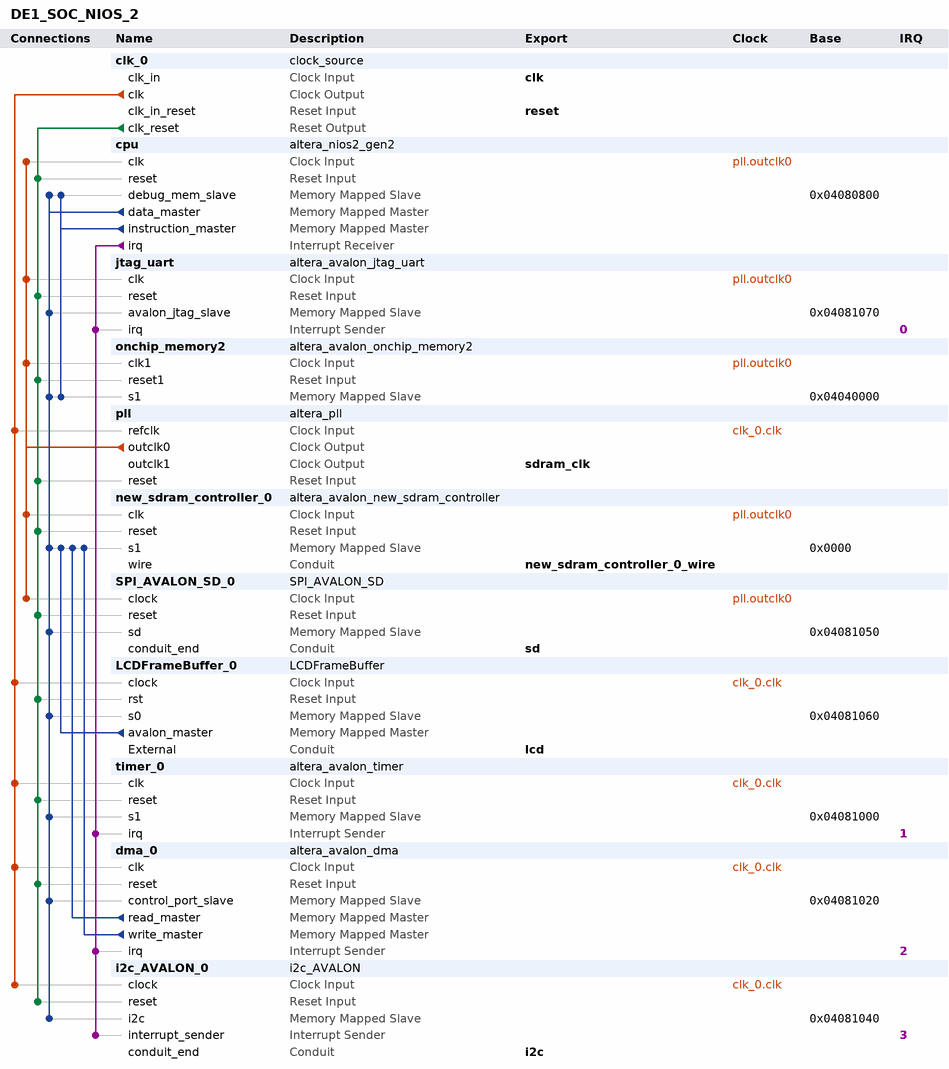
[diagram p0: system contents]
# Platform Designer (Qsys) system DE1_SOC_NIOS_2, Cyclone V 5CSEMA5F31C6
# Parameters at their usual value, and those the tool derives, are not listed.
package require -exact qsys 15.0
create_system DE1_SOC_NIOS_2
set_project_property DEVICE_FAMILY {Cyclone V}
set_project_property DEVICE 5CSEMA5F31C6

add_instance clk_0 clock_source 15.0
set_instance_parameter_value clk_0 clockFrequency 50000000

add_instance cpu altera_nios2_gen2 15.0
set_instance_parameter_value cpu dcache_size 2048
set_instance_parameter_value cpu exceptionSlave onchip_memory2.s1
set_instance_parameter_value cpu icache_size 4096
set_instance_parameter_value cpu impl Tiny
set_instance_parameter_value cpu resetSlave onchip_memory2.s1

add_instance jtag_uart altera_avalon_jtag_uart 15.0
set_instance_parameter_value jtag_uart simInteractiveOptions NO_INTERACTIVE_WINDOWS

add_instance onchip_memory2 altera_avalon_onchip_memory2 15.0
set_instance_parameter_value onchip_memory2 dataWidth 32
set_instance_parameter_value onchip_memory2 dualPort false
set_instance_parameter_value onchip_memory2 initMemContent true
set_instance_parameter_value onchip_memory2 initializationFileName onchip_mem.hex
set_instance_parameter_value onchip_memory2 memorySize 204800

add_instance pll altera_pll 15.0
set_instance_parameter_value pll gui_device_speed_grade 1
set_instance_parameter_value pll gui_number_of_clocks 2
set_instance_parameter_value pll gui_operation_mode direct
set_instance_parameter_value pll gui_output_clock_frequency0 100.0
set_instance_parameter_value pll gui_output_clock_frequency1 100.0
set_instance_parameter_value pll gui_phase_shift1 3000
set_instance_parameter_value pll gui_phase_shift_deg1 -52.0
set_instance_parameter_value pll gui_pll_mode {Integer-N PLL}
set_instance_parameter_value pll gui_reference_clock_frequency 50.0
set_instance_parameter_value pll gui_use_locked false

add_instance new_sdram_controller_0 altera_avalon_new_sdram_controller 15.0
set_instance_parameter_value new_sdram_controller_0 TAC 5.4
set_instance_parameter_value new_sdram_controller_0 TRCD 15.0
set_instance_parameter_value new_sdram_controller_0 TRP 15.0
set_instance_parameter_value new_sdram_controller_0 casLatency 3
set_instance_parameter_value new_sdram_controller_0 columnWidth 10
set_instance_parameter_value new_sdram_controller_0 dataWidth 16
set_instance_parameter_value new_sdram_controller_0 generateSimulationModel false
set_instance_parameter_value new_sdram_controller_0 model single_Micron_MT48LC4M32B2_7_chip
set_instance_parameter_value new_sdram_controller_0 numberOfBanks 4
set_instance_parameter_value new_sdram_controller_0 numberOfChipSelects 1
set_instance_parameter_value new_sdram_controller_0 powerUpDelay 100.0
set_instance_parameter_value new_sdram_controller_0 refreshPeriod 7.8125
set_instance_parameter_value new_sdram_controller_0 rowWidth 13

add_instance SPI_AVALON_SD_0 SPI_AVALON_SD 1.0

add_instance LCDFrameBuffer_0 LCDFrameBuffer 1.0

add_instance timer_0 altera_avalon_timer 15.0
set_instance_parameter_value timer_0 period 500
set_instance_parameter_value timer_0 periodUnits MSEC

add_instance dma_0 altera_avalon_dma 15.0
set_instance_parameter_value dma_0 allowByteTransactions false
set_instance_parameter_value dma_0 allowDoubleWordTransactions false
set_instance_parameter_value dma_0 allowHalfWordTransactions true
set_instance_parameter_value dma_0 allowQuadWordTransactions false
set_instance_parameter_value dma_0 allowWordTransactions false
set_instance_parameter_value dma_0 burstEnable false
set_instance_parameter_value dma_0 fifoDepth 32
set_instance_parameter_value dma_0 maxBurstSize 128
set_instance_parameter_value dma_0 minimumDmaTransactionRegisterWidth 20
set_instance_parameter_value dma_0 useRegistersForFIFO true

add_instance i2c_AVALON_0 i2c_AVALON 1.0

# connections
add_connection clk_0.clk dma_0.clk clock
add_connection clk_0.clk i2c_AVALON_0.clock clock
add_connection clk_0.clk LCDFrameBuffer_0.clock clock
add_connection clk_0.clk pll.refclk clock
add_connection clk_0.clk timer_0.clk clock
add_connection pll.outclk0 cpu.clk clock
add_connection pll.outclk0 jtag_uart.clk clock
add_connection pll.outclk0 new_sdram_controller_0.clk clock
add_connection pll.outclk0 onchip_memory2.clk1 clock
add_connection pll.outclk0 SPI_AVALON_SD_0.clock clock
add_connection clk_0.clk_reset cpu.reset reset
add_connection clk_0.clk_reset dma_0.reset reset
add_connection clk_0.clk_reset i2c_AVALON_0.reset reset
add_connection clk_0.clk_reset jtag_uart.reset reset
add_connection clk_0.clk_reset LCDFrameBuffer_0.rst reset
add_connection clk_0.clk_reset new_sdram_controller_0.reset reset
add_connection clk_0.clk_reset onchip_memory2.reset1 reset
add_connection clk_0.clk_reset pll.reset reset
add_connection clk_0.clk_reset SPI_AVALON_SD_0.reset reset
add_connection clk_0.clk_reset timer_0.reset reset
add_connection cpu.data_master cpu.debug_mem_slave avalon
set_connection_parameter_value cpu.data_master/cpu.debug_mem_slave baseAddress 0x04080800
add_connection cpu.data_master dma_0.control_port_slave avalon
set_connection_parameter_value cpu.data_master/dma_0.control_port_slave baseAddress 0x04081020
add_connection cpu.data_master i2c_AVALON_0.i2c avalon
set_connection_parameter_value cpu.data_master/i2c_AVALON_0.i2c baseAddress 0x04081040
add_connection cpu.data_master jtag_uart.avalon_jtag_slave avalon
set_connection_parameter_value cpu.data_master/jtag_uart.avalon_jtag_slave baseAddress 0x04081070
add_connection cpu.data_master LCDFrameBuffer_0.s0 avalon
set_connection_parameter_value cpu.data_master/LCDFrameBuffer_0.s0 baseAddress 0x04081060
add_connection cpu.data_master new_sdram_controller_0.s1 avalon
set_connection_parameter_value cpu.data_master/new_sdram_controller_0.s1 baseAddress 0x0000
add_connection cpu.data_master onchip_memory2.s1 avalon
set_connection_parameter_value cpu.data_master/onchip_memory2.s1 baseAddress 0x04040000
add_connection cpu.data_master SPI_AVALON_SD_0.sd avalon
set_connection_parameter_value cpu.data_master/SPI_AVALON_SD_0.sd baseAddress 0x04081050
add_connection cpu.data_master timer_0.s1 avalon
set_connection_parameter_value cpu.data_master/timer_0.s1 baseAddress 0x04081000
add_connection cpu.instruction_master cpu.debug_mem_slave avalon
set_connection_parameter_value cpu.instruction_master/cpu.debug_mem_slave baseAddress 0x04080800
add_connection cpu.instruction_master onchip_memory2.s1 avalon
set_connection_parameter_value cpu.instruction_master/onchip_memory2.s1 baseAddress 0x04040000
add_connection dma_0.read_master new_sdram_controller_0.s1 avalon
set_connection_parameter_value dma_0.read_master/new_sdram_controller_0.s1 baseAddress 0x0000
add_connection dma_0.write_master new_sdram_controller_0.s1 avalon
set_connection_parameter_value dma_0.write_master/new_sdram_controller_0.s1 baseAddress 0x0000
add_connection LCDFrameBuffer_0.avalon_master new_sdram_controller_0.s1 avalon
set_connection_parameter_value LCDFrameBuffer_0.avalon_master/new_sdram_controller_0.s1 baseAddress 0x0000
add_connection cpu.irq dma_0.irq interrupt
set_connection_parameter_value cpu.irq/dma_0.irq irqNumber 2
add_connection cpu.irq i2c_AVALON_0.interrupt_sender interrupt
set_connection_parameter_value cpu.irq/i2c_AVALON_0.interrupt_sender irqNumber 3
add_connection cpu.irq jtag_uart.irq interrupt
set_connection_parameter_value cpu.irq/jtag_uart.irq irqNumber 0
add_connection cpu.irq timer_0.irq interrupt
set_connection_parameter_value cpu.irq/timer_0.irq irqNumber 1

# exported interfaces
add_interface clk clock sink
set_interface_property clk EXPORT_OF clk_0.clk_in
add_interface i2c conduit end
set_interface_property i2c EXPORT_OF i2c_AVALON_0.conduit_end
add_interface lcd conduit end
set_interface_property lcd EXPORT_OF LCDFrameBuffer_0.External
add_interface new_sdram_controller_0_wire conduit end
set_interface_property new_sdram_controller_0_wire EXPORT_OF new_sdram_controller_0.wire
add_interface reset reset sink
set_interface_property reset EXPORT_OF clk_0.clk_in_reset
add_interface sd conduit end
set_interface_property sd EXPORT_OF SPI_AVALON_SD_0.conduit_end
add_interface sdram_clk clock source
set_interface_property sdram_clk EXPORT_OF pll.outclk1

set_interconnect_requirement {$system} qsys_mm.clockCrossingAdapter HANDSHAKE
set_interconnect_requirement {$system} qsys_mm.enableEccProtection FALSE
set_interconnect_requirement {$system} qsys_mm.insertDefaultSlave FALSE
set_interconnect_requirement {$system} qsys_mm.maxAdditionalLatency 1
set_interconnect_requirement new_sdram_controller_0.s1 qsys_mm.arbitrationScheme round-robin

save_system DE1_SOC_NIOS_2.qsys
